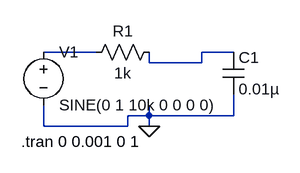
[diagram p0: schematic integrator.asc]
integrator.asc, the LTspice schematic file:
Version 4
SHEET 1 880 680
WIRE 160 128 80 128
WIRE 368 128 320 128
WIRE 240 144 240 128
WIRE 320 144 320 128
WIRE 320 144 240 144
WIRE 240 224 240 208
WIRE 240 224 208 224
WIRE 368 224 368 192
WIRE 368 224 240 224
WIRE 80 240 80 208
WIRE 208 240 208 224
WIRE 208 240 80 240
WIRE 240 240 240 224
FLAG 240 240 0
SYMBOL res 256 112 R90
WINDOW 0 0 56 VBottom 2
WINDOW 3 32 56 VTop 2
SYMATTR InstName R1
SYMATTR Value 1k
SYMBOL cap 352 128 R0
SYMATTR InstName C1
SYMATTR Value 0.01µ
SYMBOL voltage 80 112 R0
WINDOW 123 0 0 Left 0
WINDOW 39 0 0 Left 0
SYMATTR InstName V1
SYMATTR Value SINE(0 1 10k 0 0 0 0)
TEXT 46 264 Left 2 !.tran 0 0.001 0 1

The netlist it stands for:
* integrator.asc
R1 N002 N001 1k
C1 N002 0 0.01µ
V1 N001 0 SINE(0 1 10k 0 0 0 0)
.tran 0 0.001 0 1
.backanno
.end